# EAGLE design W011B (EAGLE 6.6.0)
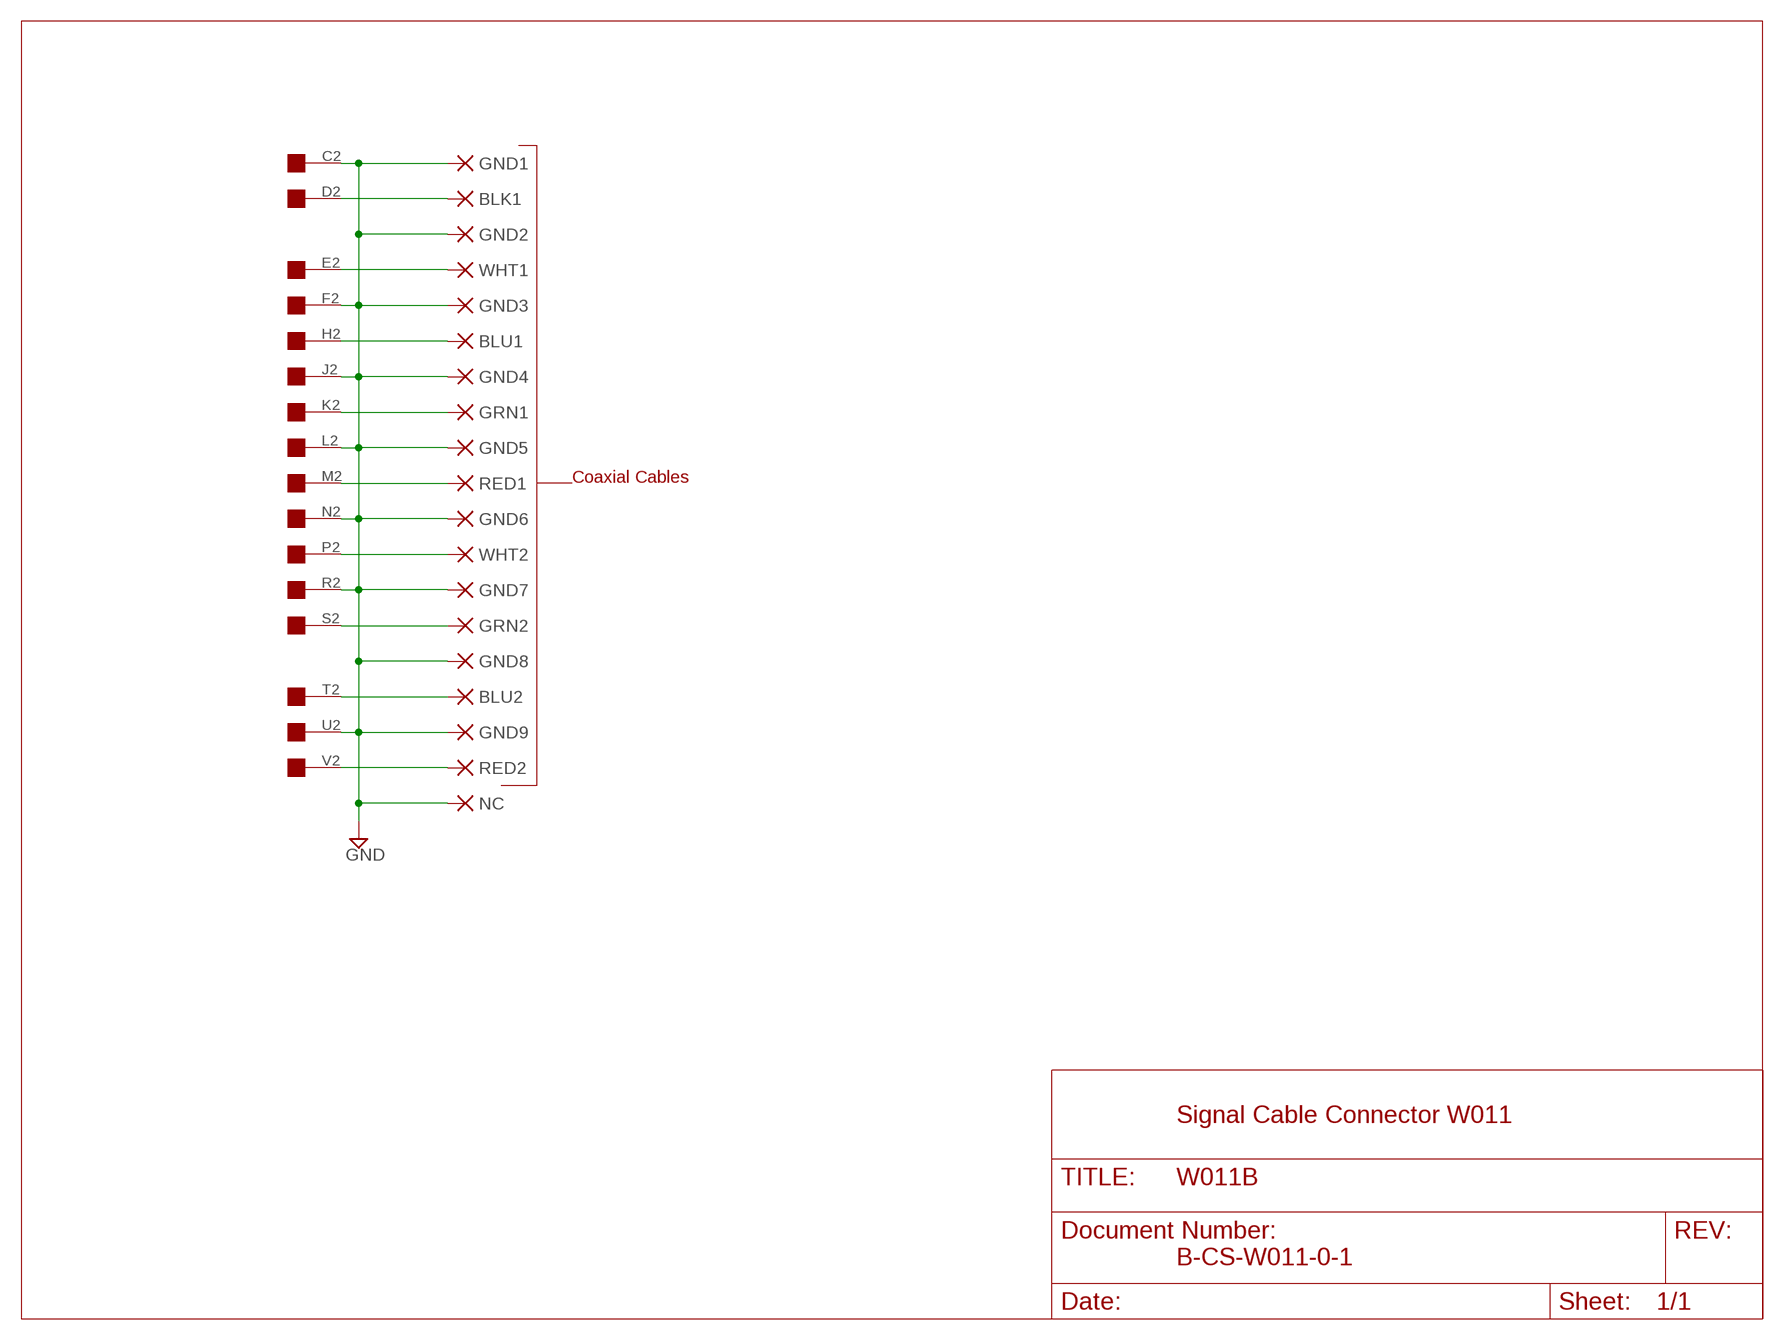
[diagram p0: schematic, sheet 1]

## Parts
BLK1  PAD-0465  [0465]
BLU1  PAD-0465  [0465]
BLU2  PAD-0465  [0465]
GND1  PAD-0465  [0465]
GND2  PAD-0465  [0465]
GND3  PAD-0465  [0465]
GND4  PAD-0465  [0465]
GND5  PAD-0465  [0465]
GND6  PAD-0465  [0465]
GND7  PAD-0465  [0465]
GND8  PAD-0465  [0465]
GND9  PAD-0465  [0465]
GRN1  PAD-0465  [0465]
GRN2  PAD-0465  [0465]
NC  PAD-0465  [0465]
RED1  PAD-0465  [0465]
RED2  PAD-0465  [0465]
U$2  EDGE-1  [EDGE-CON1]
WHT1  PAD-0465  [0465]
WHT2  PAD-0465  [0465]

## Nets
GND [Supply]: GND1.P$1(P) GND2.P$1(P) GND3.P$1(P) GND4.P$1(P) GND5.P$1(P) GND6.P$1(P) GND7.P$1(P) GND8.P$1(P) GND9.P$1(P) NC.P$1(P) U$2.C2 U$2.F2 U$2.J2 U$2.L2 U$2.N2 U$2.R2 U$2.U2
N$1 [Supply]: U$2.E2 WHT1.P$1(P)
N$2 [Supply]: BLU1.P$1(P) U$2.H2
N$3 [Supply]: GRN1.P$1(P) U$2.K2
N$4 [Supply]: RED1.P$1(P) U$2.M2
N$5 [Supply]: U$2.P2 WHT2.P$1(P)
N$6 [Supply]: GRN2.P$1(P) U$2.S2
N$7 [Supply]: BLU2.P$1(P) U$2.T2
N$8 [Supply]: RED2.P$1(P) U$2.V2
N$9: BLK1.P$1(P) U$2.D2
Unconnected: U$2.A2 U$2.B2

## Notes on the sheet
- Coaxial Cables
- Signal Cable Connector W011
- B-CS-W011-0-1

## Library data of the parts
BLK1 BLU1 BLU2 GND1-GND9 GRN1 GRN2 NC RED1 RED2 WHT1 WHT2 = dec-con:PAD: WIRE PAD Standard US Drill Sizes
U$2 = dec-con:EDGE-1: Single-Sided DEC Edge Connector -- (side 2)

## Net classes
1 Supply: width 0.813 mm

## Board
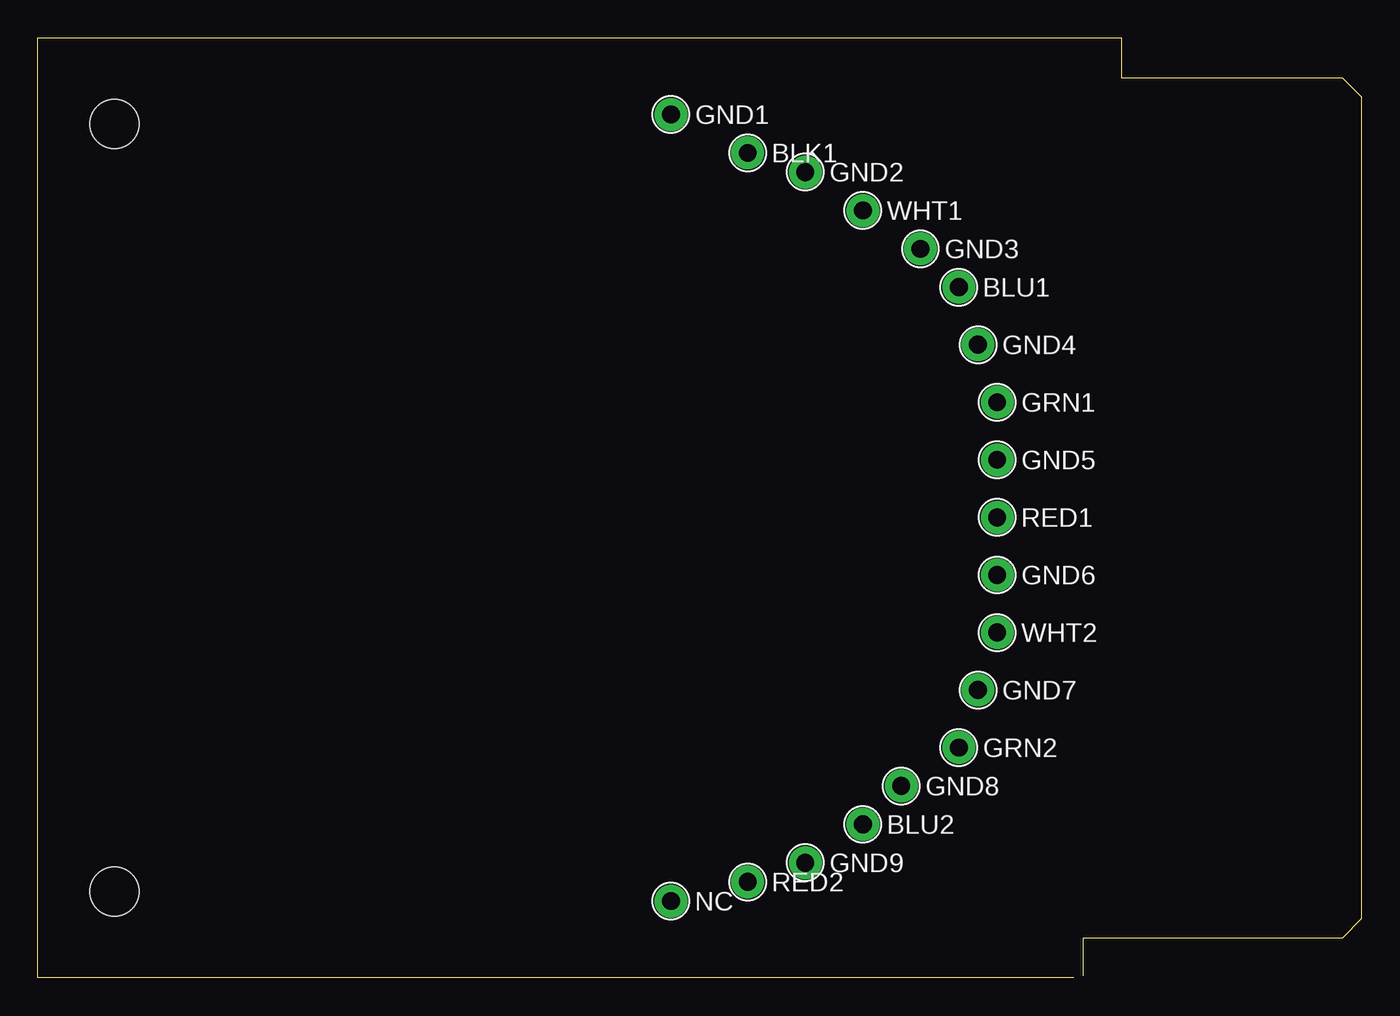
[diagram p1: board, top side]
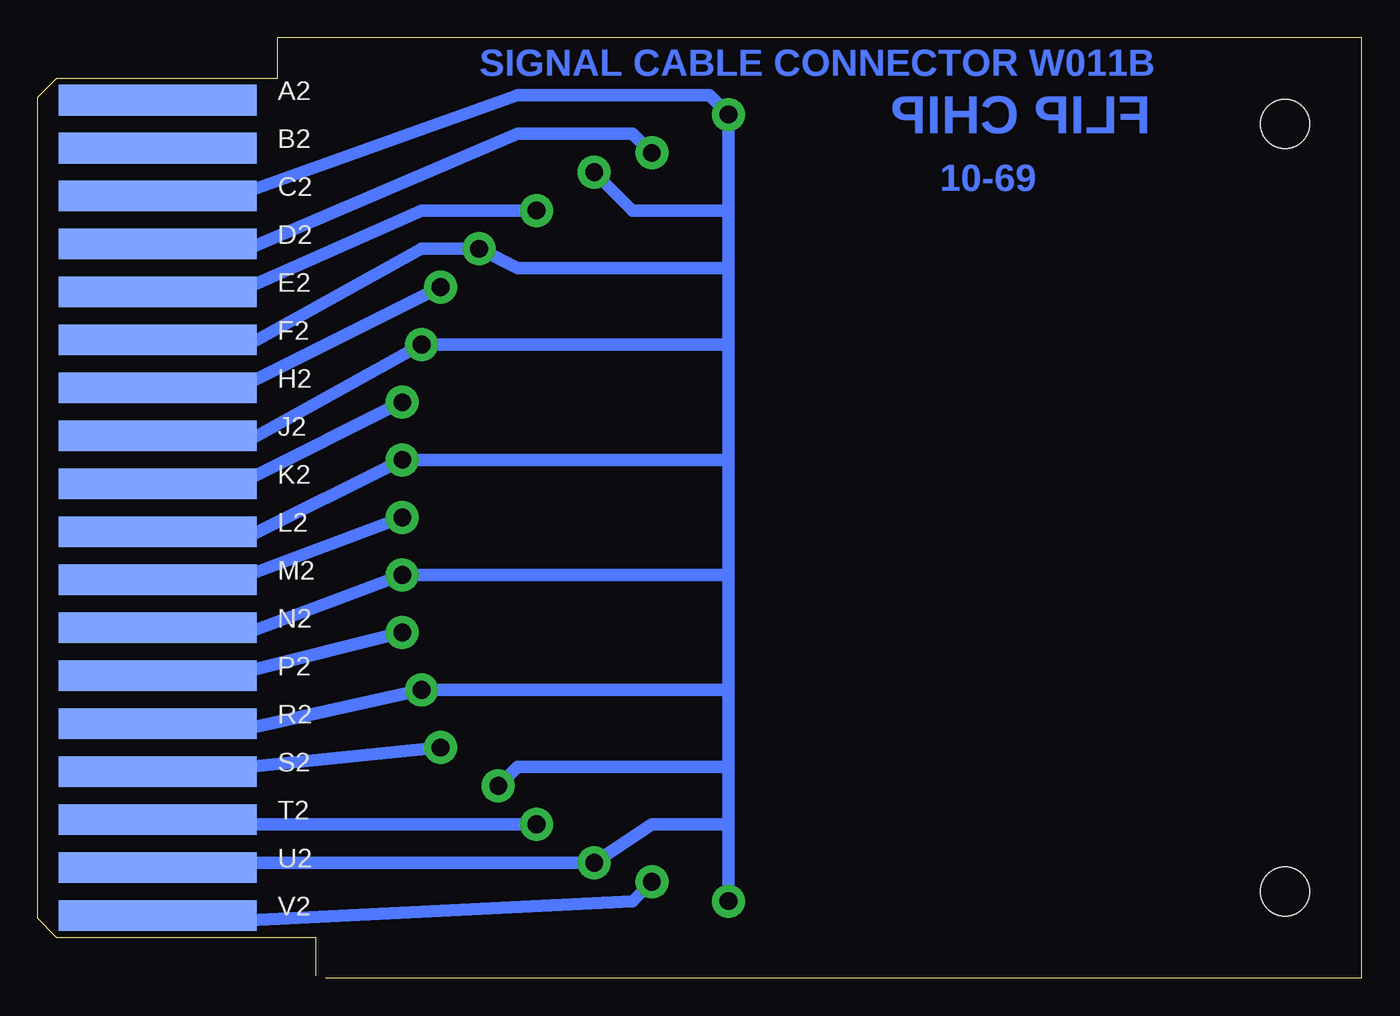
[diagram p2: board, bottom side, seen from below]

Size 87.63 x 62.23 mm. Coordinates in mm from the lower left corner, seen from the top.
Outline: 68.58,0 0,0 0,62.23 71.75,62.23
Copper layers (1+16): Top 0.035mm / dielectric 1.5mm / Bottom 0.035mm
Design rules "16mils": minimum track width 16mil, minimum drill 32mil, track to track 15mil, track to pad 10mil, pad to pad 10mil, via to via 10mil, smd to smd 10mil, copper to edge 25mil, drill to drill 10mil, minimum pad ring 10mil, minimum via ring 8mil, stop-mask expansion 0mil, vias tented up to drill 0mil, thermal gap 10mil
Holes 3.25 mm at 5.08,56.52 5.08,5.71

### Footprints (pad centres in the part's own frame; a part is rotated, then mirrored left to right if it is on the bottom)
0465 = drill 1.181 pad 2.184: P$1 0,0
EDGE-CON1 = smd 13.106 x 2.032 bottom: A2 7.938,4.128; B2 7.938,7.303; C2 7.938,10.477; D2 7.938,13.652; E2 7.938,16.828; F2 7.938,20.003; H2 7.938,23.177; J2 7.938,26.352; K2 7.938,29.527; L2 7.938,32.703; M2 7.938,35.877; N2 7.938,39.053; P2 7.938,42.227; R2 7.938,45.403; S2 7.938,48.578; T2 7.938,51.752; U2 7.938,54.928; V2 7.938,58.102

### Placement (x,y rotation side)
BLK1  46.99,54.61 0 top
BLU1  60.96,45.72 0 top
BLU2  54.61,10.16 0 top
GND1  41.91,57.15 0 top
GND2  50.8,53.34 0 top
GND3  58.42,48.26 0 top
GND4  62.23,41.91 0 top
GND5  63.5,34.29 0 top
GND6  63.5,26.67 0 top
GND7  62.23,19.05 0 top
GND8  57.15,12.7 0 top
GND9  50.8,7.62 0 top
GRN1  63.5,38.1 0 top
GRN2  60.96,15.24 0 top
NC  41.91,5.08 0 top
RED1  63.5,30.48 0 top
RED2  46.99,6.35 0 top
U$2  87.63,62.23 180 top
WHT1  54.61,50.8 0 top
WHT2  63.5,22.86 0 top

### Tracks (layer width: path | path; a pad name or v marks a point on that pad's centre or on a via)
GND
  Bottom 0.813: NC.P$1 41.91,10.16 | 41.91,10.16 41.91,13.97 | 41.91,13.97 41.91,19.05 | 41.91,19.05 41.91,26.67 | 41.91,26.67 41.91,34.29 | 41.91,34.29 41.91,41.91 | 41.91,41.91 41.91,46.99 | 41.91,46.99 41.91,50.8 | 41.91,50.8 GND1.P$1 43.18,58.42 55.88,58.42 73.66,52.07 78.74,52.07 U$2.C2 | U$2.L2 78.74,29.21 73.66,29.21 GND5.P$1 41.91,34.29 | U$2.N2 78.74,22.86 73.66,22.86 GND6.P$1 41.91,26.67 | U$2.U2 78.74,7.62 GND9.P$1 46.99,10.16 41.91,10.16 | GND8.P$1 55.88,13.97 41.91,13.97 | 41.91,19.05 GND7.P$1 73.66,16.51 78.74,16.51 U$2.R2 | 41.91,41.91 GND4.P$1 73.66,35.56 78.74,35.56 U$2.J2 | 41.91,46.99 55.88,46.99 GND3.P$1 62.23,48.26 73.66,41.91 78.74,41.91 U$2.F2 | GND2.P$1 48.26,50.8 41.91,50.8
N$1
  Bottom 0.813: U$2.E2 78.74,45.72 73.66,45.72 62.23,50.8 WHT1.P$1
N$2
  Bottom 0.813: U$2.H2 78.74,39.37 73.66,39.37 BLU1.P$1
N$3
  Bottom 0.813: U$2.K2 78.74,33.02 73.66,33.02 GRN1.P$1
N$4
  Bottom 0.813: U$2.M2 78.74,26.67 73.66,26.67 RED1.P$1
N$5
  Bottom 0.813: U$2.P2 79.07,19.99 78.74,20.32 73.66,20.32 WHT2.P$1
N$6
  Bottom 0.813: U$2.S2 78.74,13.97 73.66,13.97 GRN2.P$1
N$7
  Bottom 0.813: U$2.T2 78.74,10.16 BLU2.P$1
N$8
  Bottom 0.813: U$2.V2 78.74,3.81 73.66,3.81 48.26,5.08 RED2.P$1
N$9
  Bottom 0.813: U$2.D2 78.74,48.26 73.66,48.26 55.88,55.88 48.26,55.88 BLK1.P$1

### Text on the board
Bottom: SIGNAL CABLE CONNECTOR W011B | FLIP CHIP | 10-69
200bmp: C:/Users/Vince/Documents/websvn/trunk/Eagle/projects/DEC/Wxxx/W021/W021Abackfb.bmp